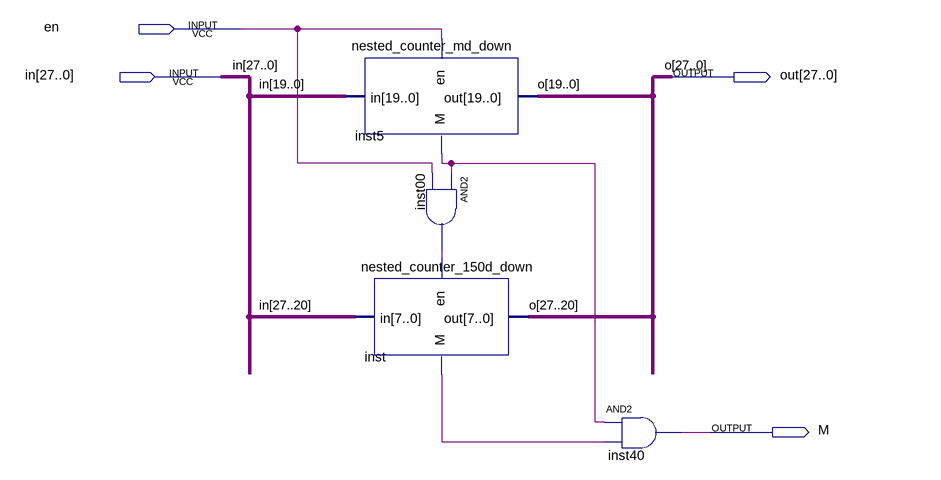
[diagram p0: schematic sheet]
// Quartus schematic nested_counter_150md_down.bdf as structural Verilog: 4 symbols, 4 pins
module nested_counter_150md_down (
  input  en,
  input  [27:0] in,
  output [27:0] out,
  output M
);

  wire inst00_out, inst5_m, inst_m;

  nested_counter_md_down inst5 (.en(en), .in(in[19:0]), .out(out[19:0]), .M(inst5_m));
  and inst00 (inst00_out, inst5_m, en);
  nested_counter_150d_down inst (.en(inst00_out), .in(in[27:20]), .out(out[27:20]), .M(inst_m));
  and inst40 (M, inst5_m, inst_m);

  // Other names for the same wires on the sheet: o[27:0] = out
endmodule
